# Altium schematic sheet Perechen_Elementov_Kursovoy_PRT.schdoc
size 209 x 297 mm
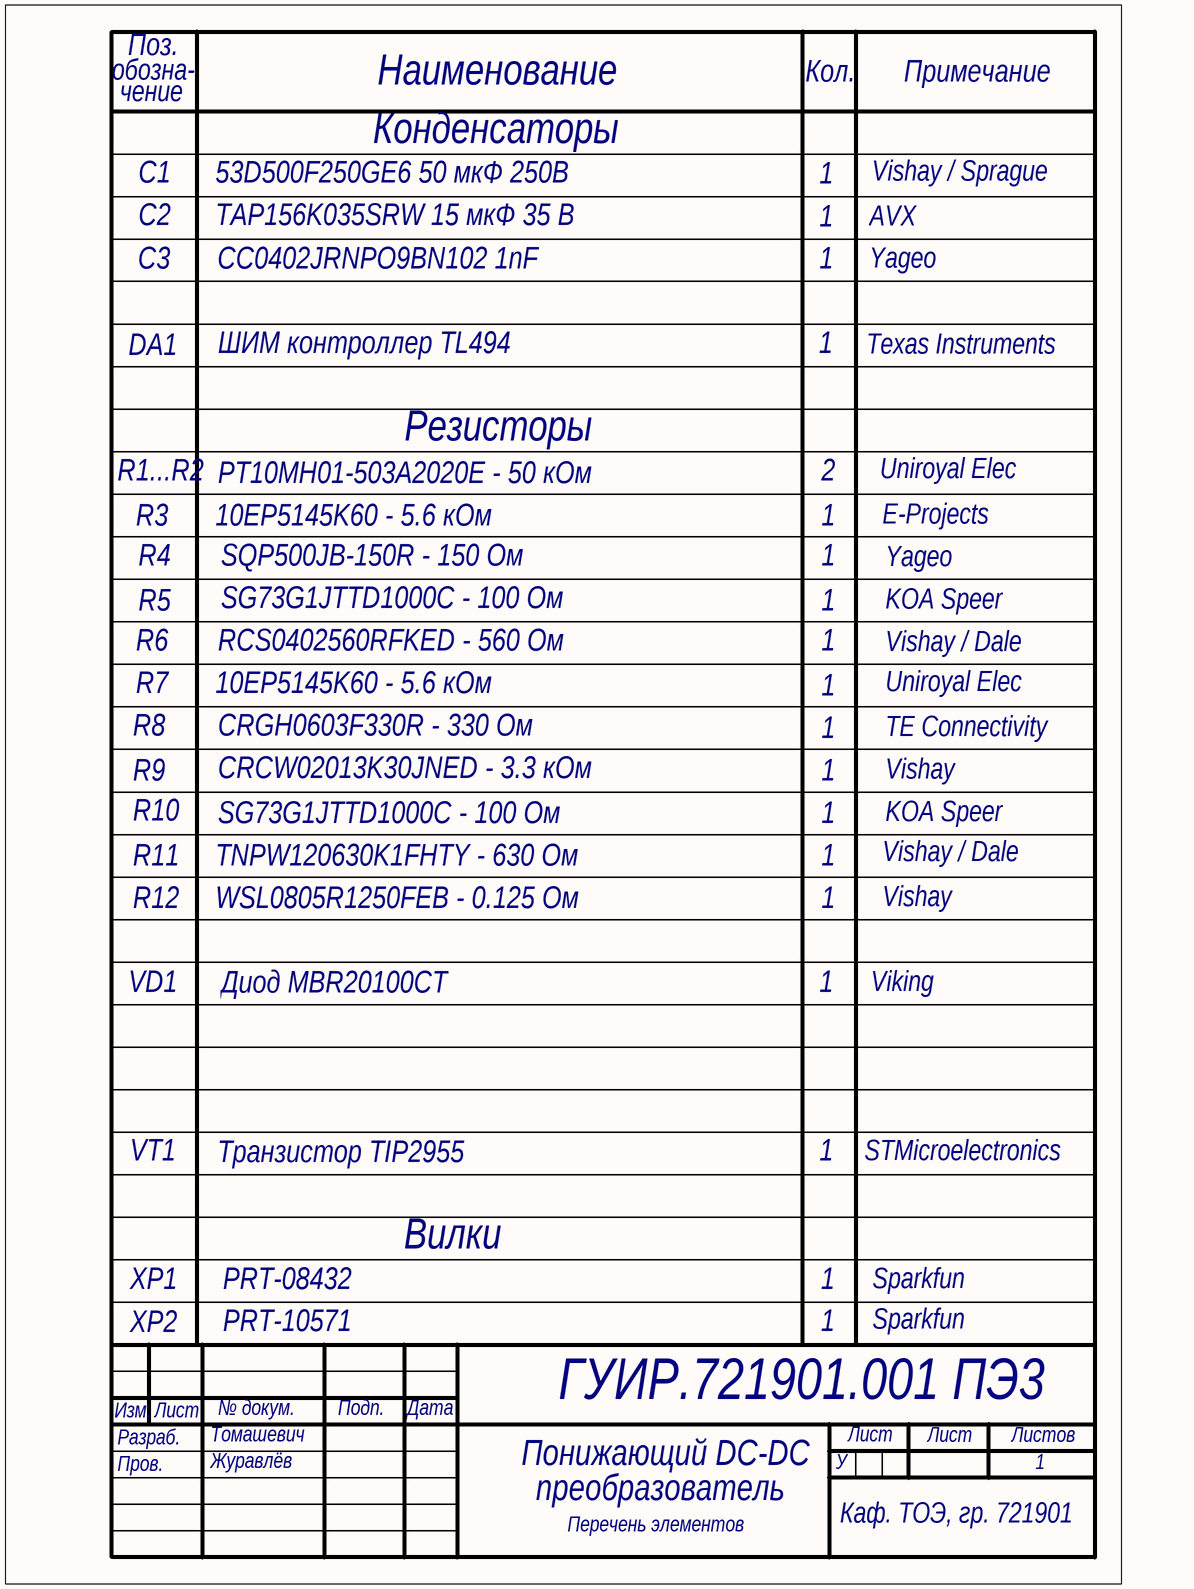
[diagram p0: Perechen_Elementov_Kursovoy_PRT.schdoc]

## Notes on the sheet
- Поз.
- обозна-
- чение
- Наименование
- Кол.
- Примечание
- С1
- 53D500F250GE6 50 мкФ 250В
- Конденсаторы
- 1
- Vishay / Sprague
- С2
- TAP156K035SRW 15 мкФ 35 В
- AVX
- С3
- CC0402JRNPO9BN102 1nF
- Yageo
- DA1
- ШИМ контроллер TL494
- Texas Instruments
- Резисторы
- R1...R2
- R3
- 10EP5145K60 - 5.6 кОм
- PT10MH01-503A2020E - 50 кОм
- 2
- Uniroyal Elec
- E-Projects
- R4
- SQP500JB-150R - 150 Ом
- R6
- R5
- RCS0402560RFKED - 560 Ом
- SG73G1JTTD1000C - 100 Ом
- KOA Speer
- Vishay / Dale
- R7
- R9
- R8
- CRGH0603F330R - 330 Ом
- CRCW02013K30JNED - 3.3 кОм
- TE Connectivity
- Vishay
- R10
- R11
- TNPW120630K1FHTY - 630 Ом
- R12
- WSL0805R1250FEB - 0.125 Ом
- VD1
- Диод MBR20100CT
- Viking
- VT1
- Транзистор TIP2955
- STMicroelectronics
- Вилки
- XP1
- XP2
- PRT-08432
- PRT-10571
- Sparkfun
- ГУИР.721901.001 ПЭ3
- Изм.
- Разраб.
- Пров.
- Лист
- Томашевич
- Журавлёв
- № докум.
- Подп.
- Дата
- Понижающий DC-DC
- У
- Листов
- преобразователь
- Перечень элементов
- Каф. ТОЭ, гр. 721901